# EAGLE design 2020can_slave_v1 (EAGLE 9.5.2)
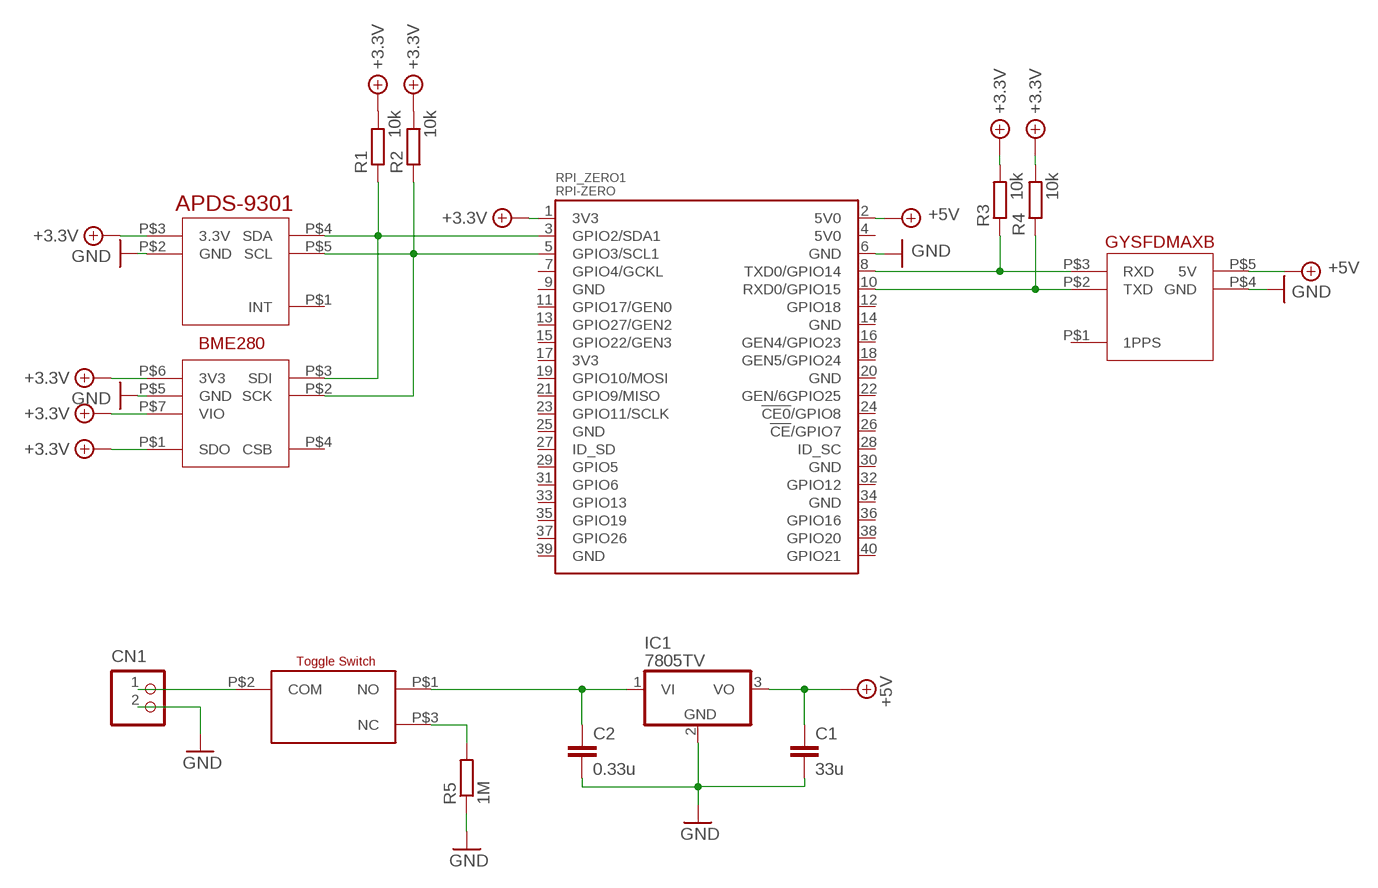
[diagram p0: schematic, sheet 1]

## Parts
APDS-9301_V1  APDS-9301_V  [APDS-9301_V]
BME280-1_V1  BME280-1_V  [BME280-1_V]
C1  33u  C5/3  [C5B3]
C2  0.33u  C5/3  [C5B3]
CN1  B2P-VH  [B2P-VH]
GYSFDMAXB_V1  GYSFDMAXB_V  [GYSFDMAXB_V]
IC1  7805TV  [TO220V]
R1  10k  R-EU_0207/10  [0207/10]
R2  10k  R-EU_0207/10  [0207/10]
R3  10k  R-EU_0207/10  [0207/10]
R4  10k  R-EU_0207/10  [0207/10]
R5  1M  R-EU_0207/10  [0207/10]
RPI_ZERO1  RPI-ZERO  [RASP_PI_ZERO_BOARD_FULL]
SWITCH_2MS1T2B4M2QES1  SWITCH_2MS1T2B4M2QES  [SWITCH_2MS1T2B4M2QES]

## Nets
+4.1V [supply]: APDS-9301_V1.P$3(3.3V) BME280-1_V1.P$6(3V3) BME280-1_V1.P$7(VIO) R1.2 R2.2 R3.2 R4.2 RPI_ZERO1.1(3V3) ; supply symbol labelled +3.3V
+5V [supply]: C1.1 GYSFDMAXB_V1.P$5(5V) IC1.3(VO) RPI_ZERO1.2(5V0)
GND [supply]: APDS-9301_V1.P$2(GND) BME280-1_V1.P$5(GND) C1.2 C2.2 CN1.2 GYSFDMAXB_V1.P$4(GND) IC1.2(GND) R5.1 RPI_ZERO1.6(GND)
N$1: APDS-9301_V1.P$4(SDA) BME280-1_V1.P$3(SDI) R1.1 RPI_ZERO1.3(GPIO2/SDA1)
N$3: APDS-9301_V1.P$5(SCL) BME280-1_V1.P$2(SCK) R2.1 RPI_ZERO1.5(GPIO3/SCL1)
N$4: R5.2 SWITCH_2MS1T2B4M2QES1.P$3(NC)
N$5: GYSFDMAXB_V1.P$3(RXD) R3.1 RPI_ZERO1.8(TXD0/GPIO14)
N$6: GYSFDMAXB_V1.P$2(TXD) R4.1 RPI_ZERO1.10(RXD0/GPIO15)
N$7: BME280-1_V1.P$1(SDO) ; supply symbol labelled +3.3V
V+ [supply]: CN1.1 SWITCH_2MS1T2B4M2QES1.P$2(COM)
VIN [supply]: C2.1 IC1.1(VI) SWITCH_2MS1T2B4M2QES1.P$1(NO)
Unconnected: APDS-9301_V1.P$1(INT) BME280-1_V1.P$4(CSB) GYSFDMAXB_V1.P$1(1PPS) RPI_ZERO1.4(5V0) RPI_ZERO1.7(GPIO4/GCKL) RPI_ZERO1.9(GND) RPI_ZERO1.11(GPIO17/GEN0) RPI_ZERO1.12(GPIO18) RPI_ZERO1.13(GPIO27/GEN2) RPI_ZERO1.14(GND) RPI_ZERO1.15(GPIO22/GEN3) RPI_ZERO1.16(GEN4/GPIO23) RPI_ZERO1.17(3V3) RPI_ZERO1.18(GEN5/GPIO24) RPI_ZERO1.19(GPIO10/MOSI) RPI_ZERO1.20(GND) RPI_ZERO1.21(GPIO9/MISO) RPI_ZERO1.22(GEN/6GPIO25) RPI_ZERO1.23(GPIO11/SCLK) RPI_ZERO1.24(!CE0!/GPIO8) RPI_ZERO1.25(GND) RPI_ZERO1.26(!CE!/GPIO7) RPI_ZERO1.27(ID_SD) RPI_ZERO1.28(ID_SC) RPI_ZERO1.29(GPIO5) RPI_ZERO1.30(GND) RPI_ZERO1.31(GPIO6) RPI_ZERO1.32(GPIO12) RPI_ZERO1.33(GPIO13) RPI_ZERO1.34(GND) RPI_ZERO1.35(GPIO19) RPI_ZERO1.36(GPIO16) RPI_ZERO1.37(GPIO26) RPI_ZERO1.38(GPIO20) RPI_ZERO1.39(GND) RPI_ZERO1.40(GPIO21)

## Library data of the parts
APDS-9301_V1 = APDS-9301:APDS-9301_V
BME280-1_V1 = BME280:BME280-1_V
C1 C2 = capacitor-wima:C: CAPACITOR naming: grid - package width
CN1 = CONN_VH:B2P-VH: Wire-to-Board 3.96mm pitch top mount connector Source: http://www.jst-mfg.com/product/pdf/jpn/VH.pdf http://www.jst-mfg.com/product/detail.php?series=262
GYSFDMAXB_V1 = GYSFDMAXB:GYSFDMAXB_V
IC1 = linear:78*: Positive VOLTAGE REGULATOR Source: http://cache.national.com/ds/LM/LM78L05.pdf http://www.fairchildsemi.com/ds/LM/LM7805.pdf
R1-R5 = rcl:R-EU_: RESISTOR, European symbol; SPICEPREFIX: R
RPI_ZERO1 = RaspberryPi_Zero:RPI-ZERO: MICON
SWITCH_2MS1T2B4M2QES1 = switch_2MS1T2B4M2QES:SWITCH_2MS1T2B4M2QES

## Net classes
1 supply: width 1 mm, clearance 0.5 mm

## Board
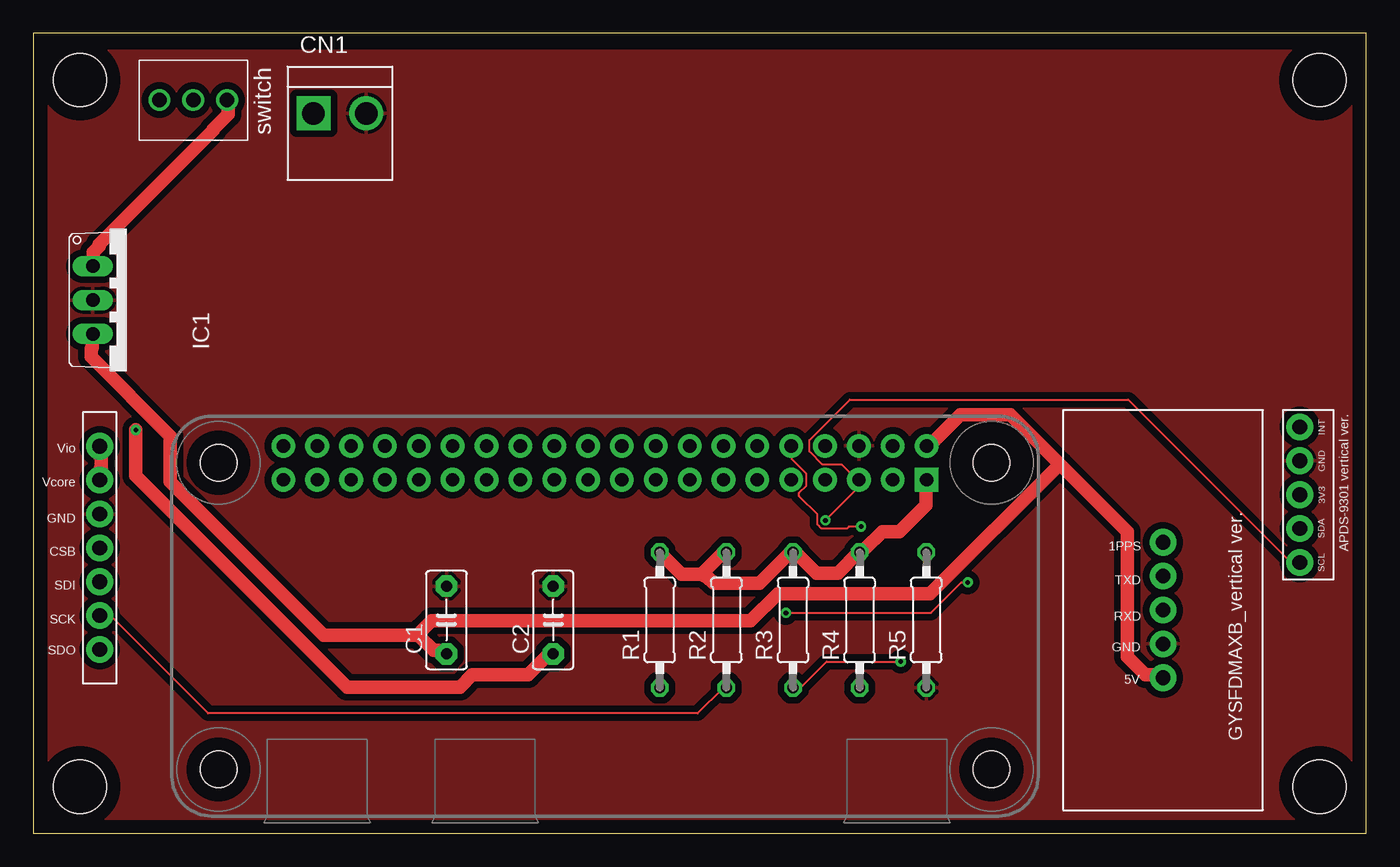
[diagram p1: board, top side]
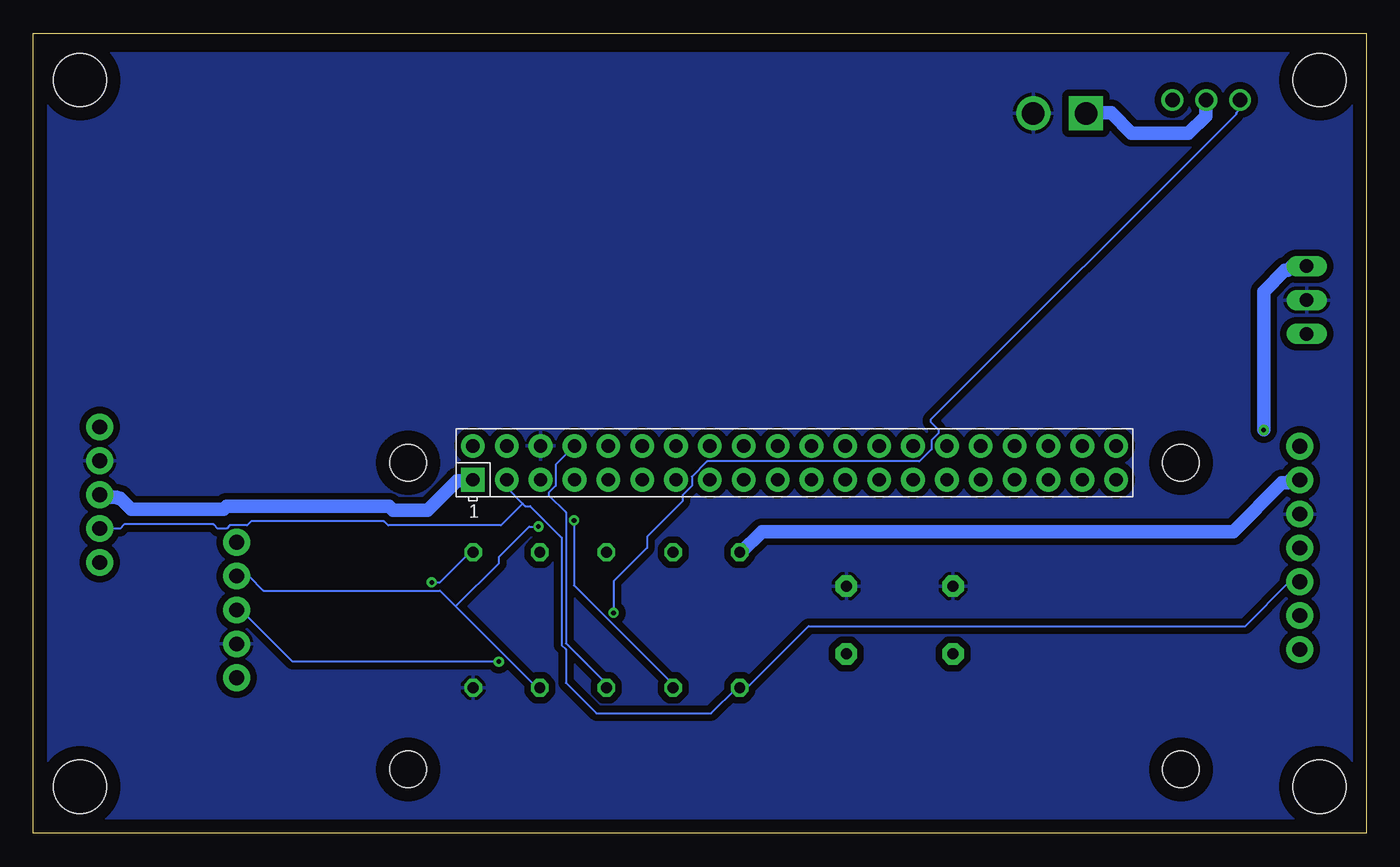
[diagram p2: board, bottom side, seen from below]

Size 100 x 60 mm. Coordinates in mm from the lower left corner, seen from the top.
Outline: 0,0 100,0 100,60 0,60 0,0
Copper layers (1*16): Top 0.035mm / dielectric 1.5mm / Bottom 0.035mm
Design rules "default": minimum track width 6mil, minimum drill 0.35mm, track to track 6mil, track to pad 6mil, pad to pad 6mil, via to via 6mil, smd to smd 6mil, copper to edge 40mil, drill to drill 6mil, minimum pad ring 10mil, minimum via ring 8mil, stop-mask expansion 4mil, vias tented up to drill 0mil, thermal gap 10mil
Holes 4 mm at 3.5,56.5 3.5,3.5 96.5,3.5 96.5,56.5
tKeepout: area 28,34 to 93,59; area 0,-7.3 to 1.5,-6.7; area 98.5,-7.3 to 100,-6.7; area 47.9,-6.6 to 52.1,-4.8; area -6.3,0 to -5.7,1.5; area -6.3,58.5 to -5.7,60; area -8.2,28.6 to -6.4,31.4; area 0,3.2 to 1.5,3.8; area 2,3.2 to 3.5,3.8; area -0.3,3.9 to 3.8,5.7; area 3.2,0 to 3.8,1.5; area 3.2,2 to 3.8,3.5; 10 more areas; 22 lines

### Footprints (pad centres in the part's own frame; a part is rotated, then mirrored left to right if it is on the bottom)
APDS-9301_V = drill 1.1 pad 2: P$1 1.27,1.27; P$2 3.81,1.27; P$3 6.35,1.27; P$4 8.89,1.27; P$5 11.43,1.27
BME280-1_V = drill 1.1 pad 2: P$1 2.54,1.27; P$2 5.08,1.27; P$3 7.62,1.27; P$4 10.16,1.27; P$5 12.7,1.27; P$6 15.24,1.27; P$7 17.78,1.27
C5B3 = drill 0.813 pad 1.6 octagon: 1 -2.54,0; 2 2.54,0
B2P-VH = drill 1.7 square: 1 -1.98,0 | drill 1.7: 2 1.98,0
GYSFDMAXB_V = drill 1.1 pad 2: P$1 7.5,9.92; P$2 7.5,12.46; P$3 7.5,15; P$4 7.5,17.54; P$5 7.5,20.08
TO220V = drill 1.016 long: 1 -2.54,-2.54; 2 0,-2.54; 3 2.54,-2.54
0207/10 = drill 0.813 octagon: 1 -5.08,0; 2 5.08,0
RASP_PI_ZERO_BOARD_FULL = drill 1 pad 1.778 square: 1 8.37,25.23 | drill 1 pad 1.778: 2 8.37,27.77; 3 10.91,25.23; 4 10.91,27.77; 5 13.45,25.23; 6 13.45,27.77; 7 15.99,25.23; 8 15.99,27.77; 9 18.53,25.23; 10 18.53,27.77; 11 21.07,25.23; 12 21.07,27.77; 13 23.61,25.23; 14 23.61,27.77; 15 26.15,25.23; 16 26.15,27.77; 17 28.69,25.23; 18 28.69,27.77; 19 31.23,25.23; 20 31.23,27.77; 21 33.77,25.23; 22 33.77,27.77; 23 36.31,25.23; 24 36.31,27.77; 25 38.85,25.23; 26 38.85,27.77; 27 41.39,25.23; 28 41.39,27.77; 29 43.93,25.23; 30 43.93,27.77; 31 46.47,25.23; 32 46.47,27.77; 33 49.01,25.23; 34 49.01,27.77; 35 51.55,25.23; 36 51.55,27.77; 37 54.09,25.23; 38 54.09,27.77; 39 56.63,25.23; 40 56.63,27.77 | hole 2.75: 3.5,3.5; 3.5,26.5; 61.5,3.5; 61.5,26.5
SWITCH_2MS1T2B4M2QES = drill 1.09: P$1 0,2.54; P$2 0,0; P$3 0,-2.54

### Placement (x,y rotation side)
APDS-9301_V1  93.75,31.75 270 top
BME280-1_V1  6.25,11.25 90 top
C1  31,16 90 top
C2  39,16 90 top
CN1  23,54 0 top
GYSFDMAXB_V1  92.25,31.75 180 top
IC1  7,40 270 top
R1  47,16 90 top
R2  52,16 90 top
R3  57,16 90 top
R4  62,16 90 top
R5  67,16 90 top
RPI_ZERO1  75.39,1.29 0 bottom
SWITCH_2MS1T2B4M2QES1  12,55 270 top

### Tracks (layer width: path | path; a pad name or v marks a point on that pad's centre or on a via)
+4.1V
  Top 1: BME280-1_V1.P$6 5.03,26.52 5.03,27.36 5.11,27.43 5.11,28.19 4.95,28.35 4.95,28.96 BME280-1_V1.P$7 | 50.14,19.43 48.62,19.43 47.02,21.03 R1.2 | 50.14,19.43 51.82,21.11 51.97,21.11 R2.2 | 50.14,19.43 50.6,19.2 51.05,18.75 54.48,18.75 56.77,21.03 57,21.03 R3.2 57.45,20.8 58.75,19.51 60.35,19.51 61.87,21.03 61.95,21.03 R4.2 62.41,21.34 63.7,22.63 65,22.63 66.98,24.61 66.98,26.52 RPI_ZERO1.1
  Bottom 1: APDS-9301_V1.P$3 94.94,25.38 94.34,25.38 94.18,25.22 93.73,25.22 93.65,25.15 93.5,25.15 92.66,24.31 85.72,24.31 85.5,24.54 73.3,24.54 73,24.23 70.41,24.23 68.2,26.44 67.13,26.44 67.06,26.52 RPI_ZERO1.1 | BME280-1_V1.P$6 5.03,26.52 5.64,26.52 5.87,26.29 6.33,26.29 9.98,22.63 45.34,22.63 46.94,21.03 R1.2
+5V
  Top 1: 77,27.7 82.07,22.63 82.07,13.26 83.44,11.89 84.12,11.89 84.28,11.73 84.73,11.73 GYSFDMAXB_V1.P$5 | 77,27.7 73.3,31.39 69.57,31.39 67.28,29.11 67.06,29.11 RPI_ZERO1.2 | 28.88,14.86 21.79,14.86 10.29,26.36 10.29,29.79 4.34,35.74 4.34,36.35 4.42,36.42 4.42,37.41 IC1.3 | 28.88,14.86 30.02,13.72 30.4,13.72 30.63,13.49 30.94,13.49 C1.1 | 77,27.7 67.28,17.98 55.85,17.98 53.8,15.93 29.87,15.93 29.18,15.24 28.88,14.86
GND
  pour Top: 1,58.75 99.25,58.75 99.25,0.75 1,0.75
  pour Bottom: 1.75,58.5 99,58.5 99,0.5 1,0.5 1,58.75
N$1
  Bottom 0.152: 63.28,24.73 64.47,25.91 64.47,26.52 RPI_ZERO1.3 | 63.28,24.73 63.09,24.54 62.71,24.54 60.35,22.17 60.35,14.1 60.05,13.79 60.05,11.28 57.76,8.99 49.15,8.99 47.24,10.9 47.02,10.9 R1.1 46.94,10.97 46.41,10.97 41.83,15.54 9.07,15.54 5.79,18.82 5.03,18.82 BME280-1_V1.P$3 | APDS-9301_V1.P$4 93.5,22.86 93.19,23.16 86.49,23.16 86.18,22.86 85.5,22.86 85.27,23.09 83.97,23.09 83.67,23.39 73.69,23.39 73.38,23.09 64.92,23.09 63.28,24.73
N$3  (via drill 0.35)
  Top 0.152: v59.44,23.47 61.87,25.91 61.87,26.52 RPI_ZERO1.5 61.8,26.52 60.66,27.66 59.21,27.66 58.22,28.65 58.22,29.49 61.27,32.54 82.14,32.54 94.34,20.34 94.94,20.34 APDS-9301_V1.P$5 | BME280-1_V1.P$2 5.03,16.31 5.79,16.31 13.11,8.99 49.84,8.99 51.74,10.9 51.97,10.9 R2.1
  Bottom 0.152: v59.44,23.47 59.44,18.59 52.05,11.2 52.05,10.97 R2.1
N$4  (via drill 0.35)
  Top 0.152: v70.1,18.82 69.65,18.82 67.36,16.54 v56.46,16.54
  Bottom 0.152: v70.1,18.82 69.49,18.82 67.28,21.03 67.06,21.03 R5.2 | v56.46,16.54 56.46,18.9 53.95,21.41 53.95,22.25 51.28,24.92 51.28,25.38 50.6,26.06 50.6,26.75 49.45,27.89 33.53,27.89 32.61,28.8 32.61,29.49 32.08,30.02 32.08,30.25 32.69,30.86 32.69,31.01 9.75,53.95 9.75,54.03 9.53,54.25 9.53,54.94 SWITCH_2MS1T2B4M2QES1.P$3
N$5  (via drill 0.35)
  Top 0.152: v65.08,12.88 59.51,12.88 57.61,10.97 57.07,10.97 R3.1
  Bottom 0.152: R3.1 57.07,10.97 57.07,11.28 60.05,14.25 60.05,24.08 61.34,25.38 61.34,25.53 60.81,26.06 60.81,27.66 59.44,29.03 RPI_ZERO1.8 | v65.08,12.88 80.54,12.88 84.35,16.69 84.73,16.69 GYSFDMAXB_V1.P$3
N$6  (via drill 0.35)
  Top 0.152: v62.1,23.01 61.19,23.01 61.04,22.86 59.13,22.86 58.83,23.16 58.83,23.93 57.45,25.3 57.45,25.53 57.99,26.06 57.99,26.98 56.92,28.04 56.92,29.03 RPI_ZERO1.10
  Bottom 0.152: 68.31,17.03 69.49,18.21 82.75,18.21 83.82,19.28 84.73,19.28 GYSFDMAXB_V1.P$2 | 68.31,17.03 62.26,10.97 62.03,10.97 R4.1 | v62.1,23.01 62.79,23.01 65.08,20.73 65.08,20.27 68.31,17.03
V+
  Bottom 1: SWITCH_2MS1T2B4M2QES1.P$2 12.04,54.94 12.04,53.8 13.34,52.5 17.6,52.5 19.13,54.03 20.95,54.03 CN1.1
VIN  (via drill 0.35)
  Top 1: IC1.1 4.5,42.6 4.5,43.59 4.95,44.04 4.95,44.2 13.49,52.73 13.49,52.81 14.63,53.95 14.63,54.86 14.55,54.94 SWITCH_2MS1T2B4M2QES1.P$1 | v7.7,30.25 7.7,26.82 23.55,10.97 32,10.97 32.92,11.89 37.11,11.89 38.63,13.41 38.94,13.41 C2.1
  Bottom 1: v7.7,30.25 7.7,40.62 6.1,42.22 5.87,42.22 5.56,42.52 4.5,42.52 IC1.1